# EAGLE schematic 彼女(仮)_回路図 (EAGLE 9.6.2)
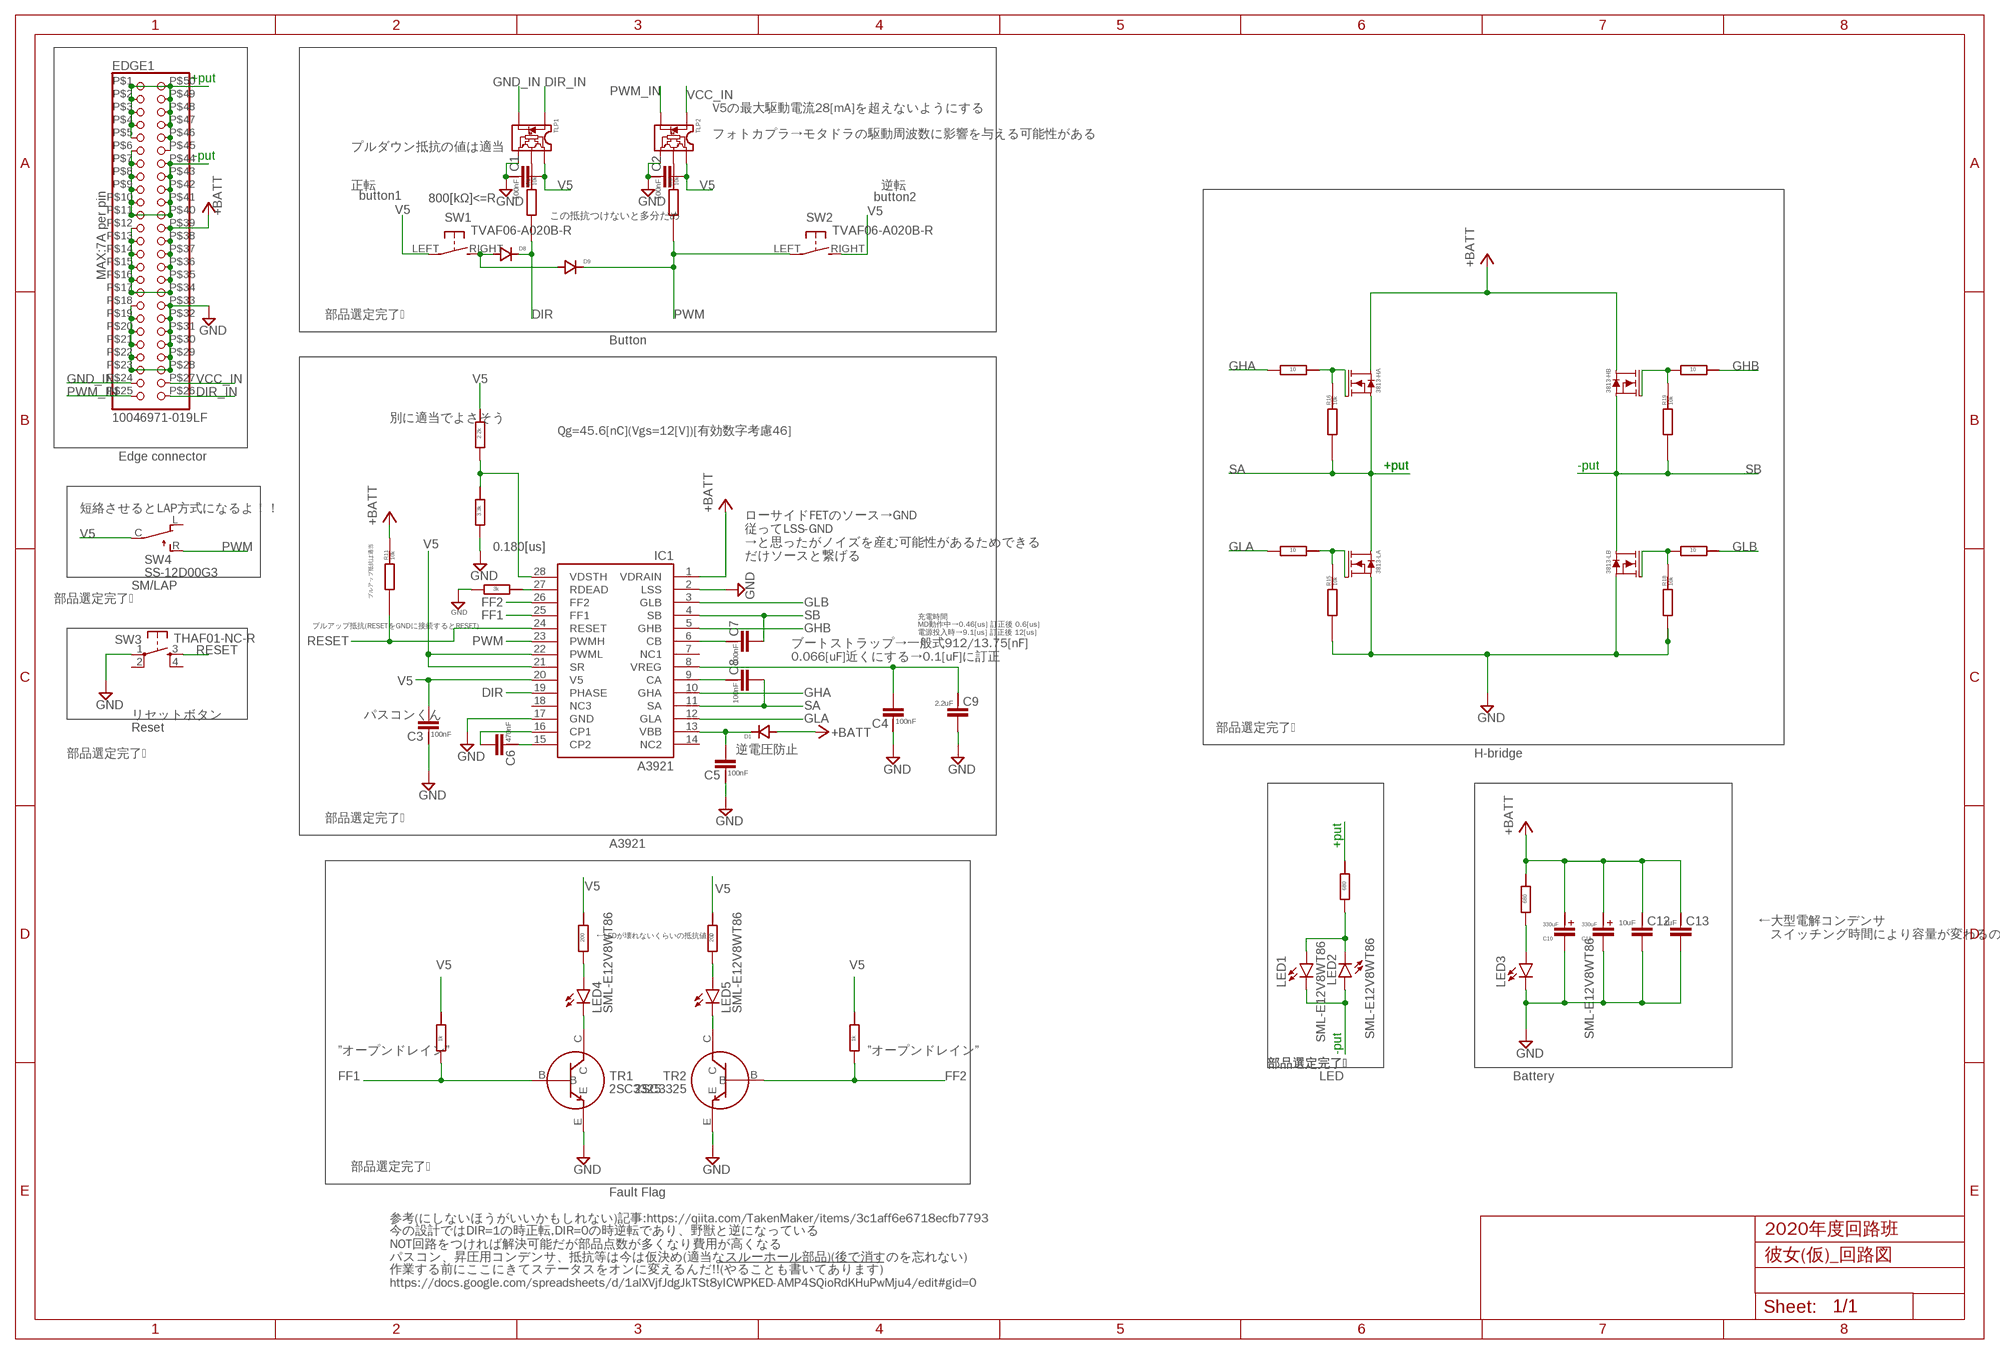
[diagram p0: schematic, sheet 1]

## Parts
3813-HA  IRLB3813NOHOLE  [TO-220AB-NOHOLE]
3813-HB  IRLB3813NOHOLE  [TO-220AB-NOHOLE]
3813-LA  IRLB3813NOHOLE  [TO-220AB-NOHOLE]
3813-LB  IRLB3813NOHOLE  [TO-220AB-NOHOLE]
C1  GCM188L81H104KA57  [GCM188L81H104KA57]
C2  GCM188L81H104KA57  [GCM188L81H104KA57]
C3  GCM188L81H104KA57  [GCM188L81H104KA57]
C4  GCM188L81H104KA57  [GCM188L81H104KA57]
C5  GCM188L81H104KA57  [GCM188L81H104KA57]
C6  GCM21BR71H474KA55  [GCM21BR71H474KA55]
C7  GCM188L81H104KA57  [GCM188L81H104KA57]
C8  GCM188L81H104KA57  [GCM188L81H104KA57]
C9  GRT31CC81H225KE01L  [GRT31CC81H225KE01L]
C10  35PZJ330M10X9  [35PZJ330M10X9]
C11  35PZJ330M10X9  [35PZJ330M10X9]
C12  GRM32ER7YA106KA12  [GRM32ER7YA106KA12]
C13  GRM21BC72A105KE01  [GRM21BC72A105KE01]
D1  GS1010FL  [GS1010FL]
D8  GS1010FL  [GS1010FL]
D9  GS1010FL  [GS1010FL]
EDGE1  10046971-019LF  [10046971-019LF]
IC1  A3921  [A3921]
LED1  SML-E12V8WT86  [SML-E12V8WT86]
LED2  SML-E12V8WT86  [SML-E12V8WT86]
LED3  SML-E12V8WT86  [SML-E12V8WT86]
LED4  SML-E12V8WT86  [SML-E12V8WT86]
LED5  SML-E12V8WT86  [SML-E12V8WT86]
R1  RG2012  [RG2012]
R2  RG2012N-332-W-T1  [RG2012]
R3  RG2012P-681-B-T5  [RG2012]
R5  RG2012-N-102-B-T5  [RG2012]
R6  RG2012-N-102-B-T5  [RG2012]
R7  RG2012N-201-W-T1  [RG2012]
R8  RG2012N-201-W-T1  [RG2012]
R9  RG2012  [RG2012]
R10  RG2012Q-100-D-T5  [RG2012]
R11  RG2012  [RG2012]
R12  RG2012Q-100-D-T5  [RG2012]
R13  RG2012P-302-B-T5  [RG2012]
R14  RG2012N-222-W-T1  [RG2012]
R15  RG2012  [RG2012]
R16  RG2012  [RG2012]
R18  RG2012  [RG2012]
R19  RG2012  [RG2012]
R20  RG2012Q-100-D-T5  [RG2012]
R21  RG2012Q-100-D-T5  [RG2012]
R22  RG2012P-681-B-T5  [RG2012]
SW1  TVAF06-A020B-R  [TVAF06-A020B-R]
SW2  TVAF06-A020B-R  [TVAF06-A020B-R]
SW3  THAF01-NC-R  [THAF01-NC-R]
SW4  SS-12D00G3  [SS-12D00G3]
TLP1  TLP2366  [TLP2366]
TLP2  TLP2366  [TLP2366]
TR1  2SC3325  [2SC3325]
TR2  2SC3325  [2SC3325]

## Nets
DIR: D8.C IC1.19(PHASE) R1.LEFT
DIR_IN: EDGE1.P$26(P26) TLP1.1(ANODE)
FF1: IC1.25(FF1) R5.RIGHT TR1.B
FF2: IC1.26(FF2) R6.RIGHT TR2.B
GHA: IC1.10(GHA) R21.RIGHT
GHB: IC1.5(GHB) R12.LEFT
GLA: IC1.12(GLA) R20.RIGHT
GLB: IC1.3(GLB) R10.LEFT
GND: 3813-LA.SOURCE(S) 3813-LB.SOURCE(S) C1.P$1 C2.P$1 C3.P$1 C4.P$1 C5.P$1 C9.P$2 C10.C(CATHODE) C11.C(CATHODE) C12.P$2 C13.P$2 EDGE1.P$18(P18) EDGE1.P$19(P19) EDGE1.P$20(P20) EDGE1.P$21(P21) EDGE1.P$22(P22) EDGE1.P$23(P23) EDGE1.P$28(P28) EDGE1.P$29(P29) EDGE1.P$30(P30) EDGE1.P$31(P31) EDGE1.P$32(P32) EDGE1.P$33(P33) IC1.2(LSS) IC1.17(GND) LED3.K(C) R2.RIGHT R13.RIGHT R15.LEFT R18.LEFT SW3.1 TLP1.4(GND) TLP2.4(GND) TR1.E TR2.E
GND_IN: EDGE1.P$24(P24) TLP1.3(CATHODE)
N$1: C6.P$1 IC1.15(CP2)
N$2: C6.P$2 IC1.16(CP1)
N$3: IC1.27(RDEAD) R13.LEFT
N$4: IC1.28(VDSTH) R2.LEFT R14.RIGHT
N$5: LED4.K(C) TR1.C
N$6: C4.P$2 C9.P$1 IC1.8(VREG)
N$7: C5.P$2 D1.C IC1.13(VBB)
N$8: LED5.K(C) TR2.C
N$9: LED4.A R7.RIGHT
N$10: LED5.A R8.RIGHT
N$11: R1.RIGHT TLP1.5(VOUT)
N$12: D8.A D9.A SW1.RIGHT(S)
N$13: 3813-HA.GATE(G) R16.RIGHT R21.LEFT
N$14: R9.RIGHT TLP2.5(VOUT)
N$15: C7.P$1 IC1.6(CB)
N$16: C8.P$1 IC1.9(CA)
N$18: LED1.A LED2.K(C) R3.RIGHT
N$21: 3813-HB.GATE(G) R12.RIGHT R19.RIGHT
N$22: LED3.A R22.RIGHT
N$25: 3813-LA.GATE(G) R15.RIGHT R20.LEFT
N$26: 3813-LB.GATE(G) R10.RIGHT R18.RIGHT
PWM: D9.C IC1.23(PWMH) R9.LEFT SW2.LEFT(P) SW4.R
PWM_IN: EDGE1.P$25(P25) TLP2.3(CATHODE)
RESET: IC1.24(RESET) R11.LEFT SW3.3
SA: 3813-HA.SOURCE(S) 3813-LA.DRAIN(D) C8.P$2 EDGE1.P$1(P1) EDGE1.P$2(P2) EDGE1.P$3(P3) EDGE1.P$4(P4) EDGE1.P$5(P5) EDGE1.P$45(P45) EDGE1.P$46(P46) EDGE1.P$47(P47) EDGE1.P$48(P48) EDGE1.P$49(P49) EDGE1.P$50(P50) IC1.11(SA) R3.LEFT R16.LEFT
SB: 3813-HB.SOURCE(S) 3813-LB.DRAIN(D) C7.P$2 EDGE1.P$6(P6) EDGE1.P$7(P7) EDGE1.P$8(P8) EDGE1.P$9(P9) EDGE1.P$10(P10) EDGE1.P$11(P11) EDGE1.P$40(P40) EDGE1.P$41(P41) EDGE1.P$42(P42) EDGE1.P$43(P43) EDGE1.P$44(P44) IC1.4(SB) LED1.K(C) LED2.A R19.LEFT
V5: C1.P$2 C2.P$2 C3.P$2 IC1.20(V5) IC1.21(SR) IC1.22(PWML) R5.LEFT R6.LEFT R7.LEFT R8.LEFT R14.LEFT SW1.LEFT(P) SW2.RIGHT(S) SW4.C TLP1.6(VCC) TLP2.6(VCC)
VCC: 3813-HA.DRAIN(D) 3813-HB.DRAIN(D) C10.A(ANODE) C11.A(ANODE) C12.P$1 C13.P$1 D1.A EDGE1.P$12(P12) EDGE1.P$13(P13) EDGE1.P$14(P14) EDGE1.P$15(P15) EDGE1.P$16(P16) EDGE1.P$17(P17) EDGE1.P$34(P34) EDGE1.P$35(P35) EDGE1.P$36(P36) EDGE1.P$37(P37) EDGE1.P$38(P38) EDGE1.P$39(P39) IC1.1(VDRAIN) R11.RIGHT R22.LEFT ; supply symbol labelled +BATT
VCC_IN: EDGE1.P$27(P27) TLP2.1(ANODE)
Unconnected: IC1.7(NC1) IC1.14(NC2) IC1.18(NC3) SW3.2 SW3.4 SW4.L

## Notes on the sheet
- +put
- V5の最大駆動電流28[mA]を超えないようにする
- フォトカプラ→モタドラの駆動周波数に影響を与える可能性がある
- プルダウン抵抗の値は適当
- -put
- 正転 | 逆転
- button1 | 800[kΩ]<=R | button2
- V5
- この抵抗つけないと多分だめ
- 部品選定完了☑
- Button
- V5
- 別に適当でよさそう
- Qg=45.6[nC](Vgs=12[V])[有効数字考慮46]
- Edge connector
- +put | +put | -put
- 短絡させるとLAP方式になるよ！！
- 0.180[us]
- ローサイドFETのソース→GND
  従ってLSS-GND
  →と思ったがノイズを産む可能性があるためできる
  だけソースと繋げる
- SM/LAP
- プルアップ抵抗は適当
- 部品選定完了☑
- FF2 | GLB
- FF1 | SB
- プルアップ抵抗(RESETをGNDに接続するとRESET)
- GHB
- 充電時間
  MD動作中→0.46[us] 訂正後 0.6[us]
  電源投入時→9.1[us] 訂正後 12[us]
- PWM
- RESET
- ブートストラップ→一般式912/13.75[nF]
  0.066[uF]近くにする→0.1[uF]に訂正
- V5 | DIR
- GHA
- SA
- リセットボタン | パスコンくん
- GLA
- Reset | 部品選定完了☑
- 逆電圧防止
- 部品選定完了☑ | H-bridge
- 部品選定完了☑
- A3921 | +put
- V5 | V5
- ←LEDが壊れないくらいの抵抗値→
- ←大型電解コンデンサ
     スイッチング時間により容量が変わるので最後にする
- V5 | V5
- ”オープンドレイン” | ”オープンドレイン” | -put
- 部品選定完了☑ | 部品選定完了☑
- LED | Battery
- 部品選定完了☑
- Fault Flag
- 参考(にしないほうがいいかもしれない)記事:https://qiita.com/TakenMaker/items/3c1aff6e6718ecfb7793
- 2020年度回路班
- 今の設計ではDIR=1の時正転,DIR=0の時逆転であり、野獣と逆になっている
  NOT回路をつければ解決可能だが部品点数が多くなり費用が高くなる
- パスコン、昇圧用コンデンサ、抵抗等は今は仮決め(適当なスルーホール部品)(後で消すのを忘れない)
- 作業する前にここにきてステータスをオンに変えるんだ!!!(やることも書いてあります)
  https://docs.google.com/spreadsheets/d/1alXVjfJdgJkTSt8yICWPKED-AMP4SQioRdKHuPwMju4/edit#gid=0

## Library data of the parts
3813-HA 3813-HB 3813-LA 3813-LB = OKUDA_libraries:IRLB3813
C1-C5 C7 C8 = GCM188L81H104K57(0.1uF):GCM188L81H104KA57
C6 = GCM21BR71H474KA55(0.47uF):GCM21BR71H474KA55
C9 = GRT31CC81H225KE01L:GRT31CC81H225KE01L
C10 C11 = 35PZJ330M10X9:35PZJ330M10X9
C12 = GRM32ER7YA106KA12(10uF):GRM32ER7YA106KA12
C13 = GRM21BC72A105KE01(1uF):GRM21BC72A105KE01
D1 D8 D9 = GS1010FL:GS1010FL
EDGE1 = 10046971-019LF:10046971-019LF
IC1 = A3921:A3921
LED1-LED5 = SML-E12V8WT86:SML-E12V8WT86
R1 R9 R11 R15 R16 R18 R19 = RG2012:RG2012
R2 = RG2012N-332-W-T1:RG2012N-332-W-T1
R3 R22 = RG2012P-681-B-T5:RG2012P-681-B-T5
R5 R6 = RG2012-N-102-B-T5:RG2012-N-102-B-T5
R7 R8 = RG2012N-201-W-T1:RG2012N-201-W-T1
R10 R12 R20 R21 = RG2012Q-100-D-T5:RG2012Q-100-D-T5
R13 = RG2012P-302-B-T5:RG2012P-302-B-T5
R14 = RG2012N-222-W-T1:RG2012N-222-W-T1
SW1 SW2 = TVAF06-A020B-R:TVAF06-A020B-R
SW3 = THAF01-NC-R:THAF01-NC-R
SW4 = SS-12D00G3:SS-12D00G3
TLP1 TLP2 = TLP2366:TLP2366
TR1 TR2 = 2SC3325:2SC3325